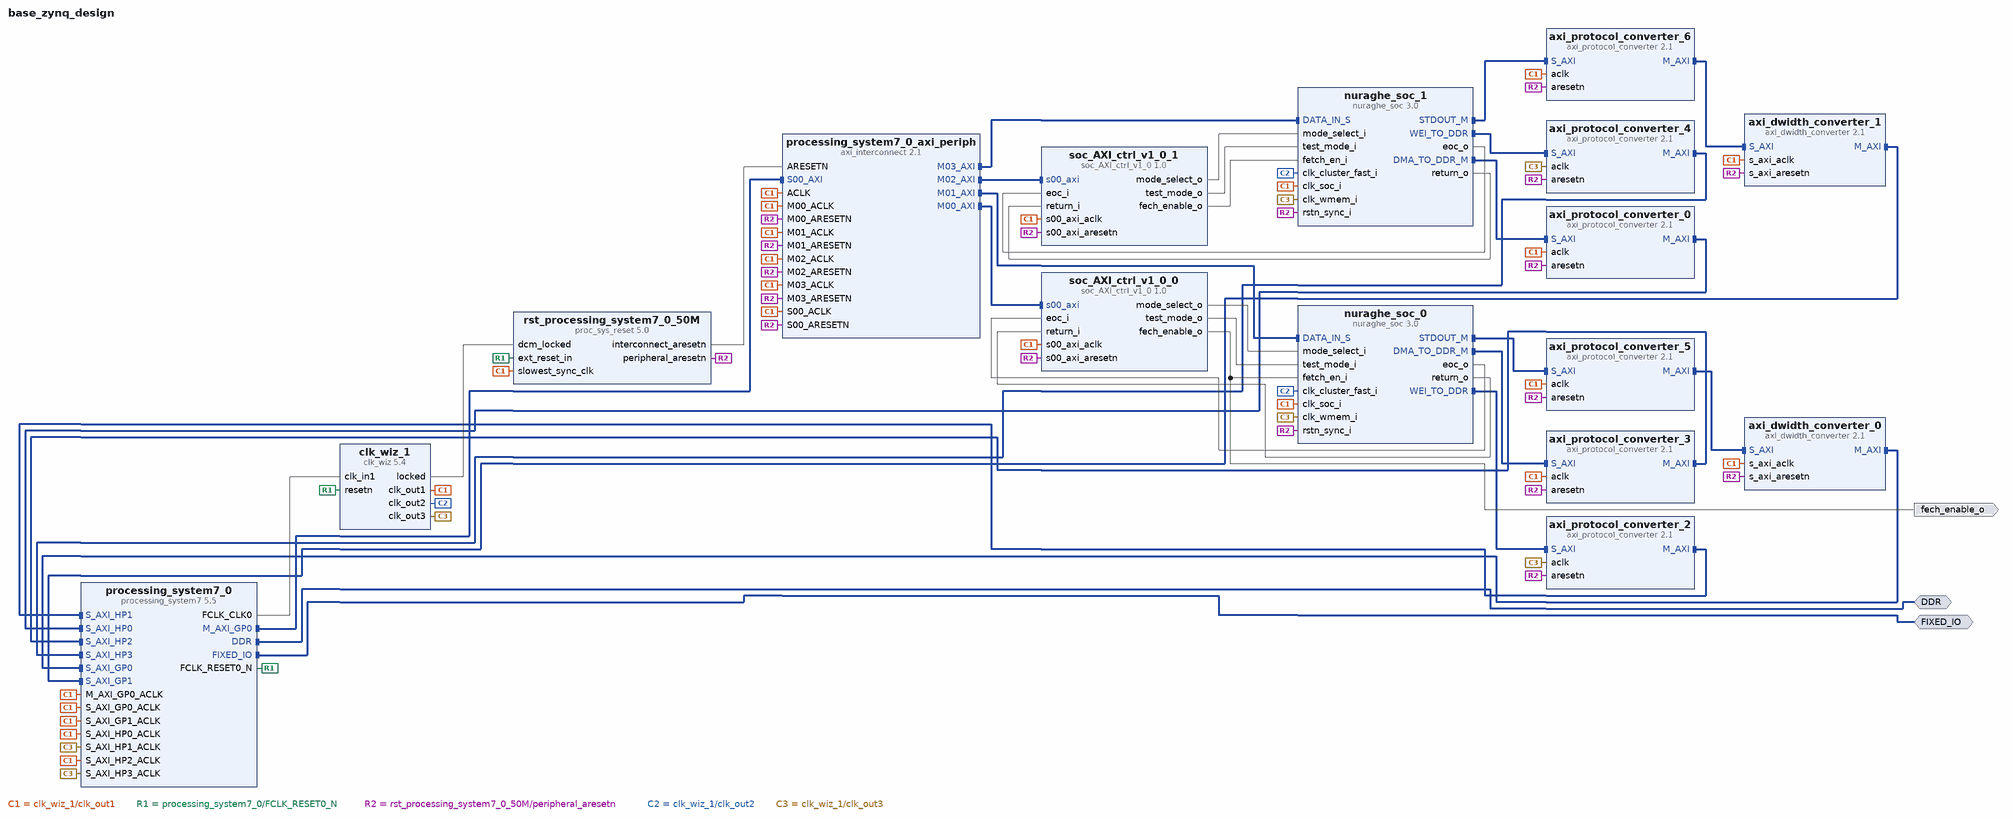
[diagram p0: block diagram of the top level]
# Vivado block design base_zynq_design, xc7z045ffg900-2, Vivado 2017.1
create_bd_design base_zynq_design

create_bd_intf_port -mode Master -vlnv xilinx.com:interface:ddrx_rtl:1.0 DDR
create_bd_intf_port -mode Master -vlnv xilinx.com:display_processing_system7:fixedio_rtl:1.0 FIXED_IO
create_bd_port -dir O fech_enable_o

create_bd_cell -type ip -vlnv xilinx.com:ip:clk_wiz:5.4 clk_wiz_1
set_property -dict [list \
  CONFIG.ENABLE_CLOCK_MONITOR false \
  CONFIG.PRIMITIVE MMCM \
  CONFIG.CLKOUT1_USED true \
  CONFIG.CLKOUT2_USED true \
  CONFIG.CLKOUT3_USED true \
  CONFIG.NUM_OUT_CLKS 3 \
  CONFIG.CLKOUT1_REQUESTED_OUT_FREQ 10 \
  CONFIG.CLKOUT2_REQUESTED_OUT_FREQ 20 \
  CONFIG.CLKOUT3_REQUESTED_OUT_FREQ 20 \
  CONFIG.FEEDBACK_SOURCE FDBK_AUTO \
  CONFIG.USE_LOCKED true \
  CONFIG.RESET_PORT resetn \
  CONFIG.MMCM_DIVCLK_DIVIDE 1 \
  CONFIG.MMCM_CLKFBOUT_MULT_F 10.000 \
  CONFIG.MMCM_CLKIN1_PERIOD 10.000 \
  CONFIG.MMCM_CLKIN2_PERIOD 10.000 \
  CONFIG.MMCM_COMPENSATION ZHOLD \
  CONFIG.MMCM_CLKOUT0_DIVIDE_F 100.000 \
  CONFIG.MMCM_CLKOUT1_DIVIDE 50 \
  CONFIG.MMCM_CLKOUT2_DIVIDE 50 \
  CONFIG.RESET_TYPE ACTIVE_LOW \
  CONFIG.CLKOUT1_JITTER 209.588 \
  CONFIG.CLKOUT1_PHASE_ERROR 98.575 \
  CONFIG.CLKOUT2_JITTER 183.243 \
  CONFIG.CLKOUT2_PHASE_ERROR 98.575 \
  CONFIG.CLKOUT3_JITTER 183.243 \
  CONFIG.CLKOUT3_PHASE_ERROR 98.575 \
] [get_bd_cells clk_wiz_1]
create_bd_cell -type ip -vlnv xilinx.com:ip:processing_system7:5.5 processing_system7_0
set_property -dict [list \
  CONFIG.PCW_UIPARAM_DDR_FREQ_MHZ 533.333313 \
  CONFIG.PCW_APU_PERIPHERAL_FREQMHZ 667.000000 \
  CONFIG.PCW_SDIO_PERIPHERAL_FREQMHZ 50 \
  CONFIG.PCW_UART_PERIPHERAL_FREQMHZ 50 \
  CONFIG.PCW_I2C_PERIPHERAL_FREQMHZ 111.111115 \
  CONFIG.PCW_FPGA0_PERIPHERAL_FREQMHZ 100 \
  CONFIG.PCW_FPGA1_PERIPHERAL_FREQMHZ 100 \
  CONFIG.PCW_USE_S_AXI_GP0 1 \
  CONFIG.PCW_USE_S_AXI_GP1 1 \
  CONFIG.PCW_USE_S_AXI_HP0 1 \
  CONFIG.PCW_USE_S_AXI_HP1 1 \
  CONFIG.PCW_USE_S_AXI_HP2 1 \
  CONFIG.PCW_USE_S_AXI_HP3 1 \
  CONFIG.PCW_PRESET_BANK0_VOLTAGE {LVCMOS 1.8V} \
  CONFIG.PCW_PRESET_BANK1_VOLTAGE {LVCMOS 1.8V} \
  CONFIG.PCW_UIPARAM_DDR_PARTNO Custom \
  CONFIG.PCW_QSPI_PERIPHERAL_ENABLE 1 \
  CONFIG.PCW_QSPI_QSPI_IO {MIO 1 .. 6} \
  CONFIG.PCW_QSPI_GRP_IO1_ENABLE 1 \
  CONFIG.PCW_QSPI_GRP_IO1_IO {MIO 0 9 .. 13} \
  CONFIG.PCW_QSPI_GRP_FBCLK_ENABLE 1 \
  CONFIG.PCW_QSPI_GRP_FBCLK_IO {MIO 8} \
  CONFIG.PCW_QSPI_INTERNAL_HIGHADDRESS 0xFDFFFFFF \
  CONFIG.PCW_ENET0_PERIPHERAL_ENABLE 1 \
  CONFIG.PCW_ENET0_ENET0_IO {MIO 16 .. 27} \
  CONFIG.PCW_ENET0_GRP_MDIO_ENABLE 1 \
  CONFIG.PCW_ENET0_GRP_MDIO_IO {MIO 52 .. 53} \
  CONFIG.PCW_ENET_RESET_ENABLE 1 \
  CONFIG.PCW_ENET_RESET_SELECT {Share reset pin} \
  CONFIG.PCW_ENET0_RESET_ENABLE 1 \
  CONFIG.PCW_ENET0_RESET_IO {MIO 47} \
  CONFIG.PCW_SD0_PERIPHERAL_ENABLE 1 \
  CONFIG.PCW_SD0_SD0_IO {MIO 40 .. 45} \
  CONFIG.PCW_SD0_GRP_CD_ENABLE 1 \
  CONFIG.PCW_SD0_GRP_CD_IO {MIO 14} \
  CONFIG.PCW_SD0_GRP_WP_ENABLE 1 \
  CONFIG.PCW_SD0_GRP_WP_IO {MIO 15} \
  CONFIG.PCW_UART1_PERIPHERAL_ENABLE 1 \
  CONFIG.PCW_UART1_UART1_IO {MIO 48 .. 49} \
  CONFIG.PCW_TTC0_PERIPHERAL_ENABLE 1 \
  CONFIG.PCW_TTC0_TTC0_IO EMIO \
  CONFIG.PCW_USB0_PERIPHERAL_ENABLE 1 \
  CONFIG.PCW_USB0_USB0_IO {MIO 28 .. 39} \
  CONFIG.PCW_USB_RESET_ENABLE 1 \
  CONFIG.PCW_USB_RESET_SELECT {Share reset pin} \
  CONFIG.PCW_USB0_RESET_ENABLE 1 \
  CONFIG.PCW_USB0_RESET_IO {MIO 7} \
  CONFIG.PCW_I2C0_PERIPHERAL_ENABLE 1 \
  CONFIG.PCW_I2C0_I2C0_IO {MIO 50 .. 51} \
  CONFIG.PCW_I2C0_RESET_ENABLE 1 \
  CONFIG.PCW_I2C0_RESET_IO {MIO 46} \
  CONFIG.PCW_I2C_RESET_ENABLE 1 \
  CONFIG.PCW_I2C_RESET_SELECT {Share reset pin} \
  CONFIG.PCW_GPIO_MIO_GPIO_ENABLE 1 \
  CONFIG.PCW_GPIO_MIO_GPIO_IO MIO \
  CONFIG.PCW_ENET0_PERIPHERAL_FREQMHZ {100 Mbps} \
  CONFIG.preset ZC706 \
] [get_bd_cells processing_system7_0]
# 189 more settings of processing_system7_0 are not shown: defaults, MIO pin electricals, DDR timing, and values the tool derives
create_bd_cell -type ip -vlnv xilinx.com:ip:axi_interconnect:2.1 processing_system7_0_axi_periph
set_property -dict {CONFIG.NUM_MI 4} [get_bd_cells processing_system7_0_axi_periph]
create_bd_cell -type ip -vlnv xilinx.com:ip:proc_sys_reset:5.0 rst_processing_system7_0_50M
create_bd_cell -type ip -vlnv xilinx.com:ip:axi_protocol_converter:2.1 axi_protocol_converter_2
create_bd_cell -type ip -vlnv xilinx.com:ip:axi_protocol_converter:2.1 axi_protocol_converter_0
create_bd_cell -type ip -vlnv xilinx.com:ip:axi_protocol_converter:2.1 axi_protocol_converter_3
set_property -dict [list \
  CONFIG.AWUSER_WIDTH 6 \
  CONFIG.ARUSER_WIDTH 6 \
  CONFIG.RUSER_WIDTH 6 \
  CONFIG.WUSER_WIDTH 6 \
] [get_bd_cells axi_protocol_converter_3]
create_bd_cell -type ip -vlnv user.org:user:soc_AXI_ctrl_v1_0:1.0 soc_AXI_ctrl_v1_0_0
set_property -dict {CONFIG.C_S00_AXI_ID_WIDTH 12} [get_bd_cells soc_AXI_ctrl_v1_0_0]
create_bd_cell -type ip -vlnv uniCA:user:nuraghe_soc:3.0 nuraghe_soc_0
create_bd_cell -type ip -vlnv uniCA:user:nuraghe_soc:3.0 nuraghe_soc_1
create_bd_cell -type ip -vlnv user.org:user:soc_AXI_ctrl_v1_0:1.0 soc_AXI_ctrl_v1_0_1
set_property -dict {CONFIG.C_S00_AXI_ID_WIDTH 12} [get_bd_cells soc_AXI_ctrl_v1_0_1]
create_bd_cell -type ip -vlnv xilinx.com:ip:axi_protocol_converter:2.1 axi_protocol_converter_4
create_bd_cell -type ip -vlnv xilinx.com:ip:axi_protocol_converter:2.1 axi_protocol_converter_5
set_property -dict [list \
  CONFIG.AWUSER_WIDTH 6 \
  CONFIG.ARUSER_WIDTH 6 \
  CONFIG.RUSER_WIDTH 6 \
  CONFIG.WUSER_WIDTH 6 \
] [get_bd_cells axi_protocol_converter_5]
create_bd_cell -type ip -vlnv xilinx.com:ip:axi_dwidth_converter:2.1 axi_dwidth_converter_0
create_bd_cell -type ip -vlnv xilinx.com:ip:axi_dwidth_converter:2.1 axi_dwidth_converter_1
create_bd_cell -type ip -vlnv xilinx.com:ip:axi_protocol_converter:2.1 axi_protocol_converter_6
set_property -dict [list \
  CONFIG.AWUSER_WIDTH 6 \
  CONFIG.ARUSER_WIDTH 6 \
  CONFIG.RUSER_WIDTH 6 \
  CONFIG.WUSER_WIDTH 6 \
] [get_bd_cells axi_protocol_converter_6]

# ---- connections ----

connect_bd_intf_net [get_bd_intf_pins processing_system7_0/M_AXI_GP0] [get_bd_intf_pins processing_system7_0_axi_periph/S00_AXI]
connect_bd_intf_net [get_bd_intf_pins soc_AXI_ctrl_v1_0_0/s00_axi] [get_bd_intf_pins processing_system7_0_axi_periph/M00_AXI]
connect_bd_intf_net [get_bd_intf_pins processing_system7_0/S_AXI_HP1] [get_bd_intf_pins axi_protocol_converter_2/M_AXI]
connect_bd_intf_net [get_bd_intf_pins processing_system7_0_axi_periph/M01_AXI] [get_bd_intf_pins nuraghe_soc_0/DATA_IN_S]
connect_bd_intf_net [get_bd_intf_pins axi_protocol_converter_0/M_AXI] [get_bd_intf_pins processing_system7_0/S_AXI_HP0]
connect_bd_intf_net [get_bd_intf_pins axi_protocol_converter_3/M_AXI] [get_bd_intf_pins processing_system7_0/S_AXI_HP2]
connect_bd_intf_net [get_bd_intf_pins nuraghe_soc_0/WEI_TO_DDR] [get_bd_intf_pins axi_protocol_converter_2/S_AXI]
connect_bd_intf_net [get_bd_intf_pins nuraghe_soc_0/DMA_TO_DDR_M] [get_bd_intf_pins axi_protocol_converter_3/S_AXI]
connect_bd_intf_net [get_bd_intf_pins soc_AXI_ctrl_v1_0_1/s00_axi] [get_bd_intf_pins processing_system7_0_axi_periph/M02_AXI]
connect_bd_intf_net [get_bd_intf_pins processing_system7_0_axi_periph/M03_AXI] [get_bd_intf_pins nuraghe_soc_1/DATA_IN_S]
connect_bd_intf_net [get_bd_intf_pins nuraghe_soc_1/DMA_TO_DDR_M] [get_bd_intf_pins axi_protocol_converter_0/S_AXI]
connect_bd_intf_net [get_bd_intf_pins axi_protocol_converter_4/M_AXI] [get_bd_intf_pins processing_system7_0/S_AXI_HP3]
connect_bd_intf_net [get_bd_intf_pins nuraghe_soc_1/WEI_TO_DDR] [get_bd_intf_pins axi_protocol_converter_4/S_AXI]
connect_bd_intf_net [get_bd_intf_pins nuraghe_soc_0/STDOUT_M] [get_bd_intf_pins axi_protocol_converter_5/S_AXI]
connect_bd_intf_net [get_bd_intf_pins axi_protocol_converter_5/M_AXI] [get_bd_intf_pins axi_dwidth_converter_0/S_AXI]
connect_bd_intf_net [get_bd_intf_pins axi_dwidth_converter_0/M_AXI] [get_bd_intf_pins processing_system7_0/S_AXI_GP0]
connect_bd_intf_net [get_bd_intf_pins axi_protocol_converter_6/M_AXI] [get_bd_intf_pins axi_dwidth_converter_1/S_AXI]
connect_bd_intf_net [get_bd_intf_pins axi_dwidth_converter_1/M_AXI] [get_bd_intf_pins processing_system7_0/S_AXI_GP1]
connect_bd_intf_net [get_bd_intf_pins nuraghe_soc_1/STDOUT_M] [get_bd_intf_pins axi_protocol_converter_6/S_AXI]
connect_bd_intf_net [get_bd_intf_ports DDR] [get_bd_intf_pins processing_system7_0/DDR]
connect_bd_intf_net [get_bd_intf_ports FIXED_IO] [get_bd_intf_pins processing_system7_0/FIXED_IO]
connect_bd_net -net processing_system7_0_FCLK_CLK0 [get_bd_pins clk_wiz_1/clk_out1] \
  [get_bd_pins processing_system7_0/M_AXI_GP0_ACLK] [get_bd_pins processing_system7_0/S_AXI_GP0_ACLK] \
  [get_bd_pins processing_system7_0/S_AXI_HP0_ACLK] [get_bd_pins rst_processing_system7_0_50M/slowest_sync_clk] \
  [get_bd_pins processing_system7_0/S_AXI_HP2_ACLK] [get_bd_pins axi_protocol_converter_0/aclk] \
  [get_bd_pins axi_protocol_converter_3/aclk] [get_bd_pins soc_AXI_ctrl_v1_0_0/s00_axi_aclk] \
  [get_bd_pins nuraghe_soc_0/clk_soc_i] [get_bd_pins processing_system7_0_axi_periph/ACLK] \
  [get_bd_pins processing_system7_0_axi_periph/S00_ACLK] [get_bd_pins processing_system7_0_axi_periph/M00_ACLK] \
  [get_bd_pins processing_system7_0_axi_periph/M01_ACLK] [get_bd_pins nuraghe_soc_1/clk_soc_i] \
  [get_bd_pins soc_AXI_ctrl_v1_0_1/s00_axi_aclk] [get_bd_pins processing_system7_0/S_AXI_GP1_ACLK] \
  [get_bd_pins processing_system7_0_axi_periph/M02_ACLK] [get_bd_pins processing_system7_0_axi_periph/M03_ACLK] \
  [get_bd_pins axi_protocol_converter_5/aclk] [get_bd_pins axi_dwidth_converter_0/s_axi_aclk] \
  [get_bd_pins axi_protocol_converter_6/aclk] [get_bd_pins axi_dwidth_converter_1/s_axi_aclk]
connect_bd_net [get_bd_pins processing_system7_0/FCLK_RESET0_N] [get_bd_pins clk_wiz_1/resetn] [get_bd_pins rst_processing_system7_0_50M/ext_reset_in]
connect_bd_net [get_bd_pins rst_processing_system7_0_50M/peripheral_aresetn] \
  [get_bd_pins axi_protocol_converter_2/aresetn] [get_bd_pins axi_protocol_converter_0/aresetn] \
  [get_bd_pins axi_protocol_converter_3/aresetn] [get_bd_pins soc_AXI_ctrl_v1_0_0/s00_axi_aresetn] \
  [get_bd_pins nuraghe_soc_0/rstn_sync_i] [get_bd_pins processing_system7_0_axi_periph/S00_ARESETN] \
  [get_bd_pins processing_system7_0_axi_periph/M00_ARESETN] [get_bd_pins processing_system7_0_axi_periph/M01_ARESETN] \
  [get_bd_pins nuraghe_soc_1/rstn_sync_i] [get_bd_pins soc_AXI_ctrl_v1_0_1/s00_axi_aresetn] \
  [get_bd_pins axi_protocol_converter_4/aresetn] [get_bd_pins processing_system7_0_axi_periph/M03_ARESETN] \
  [get_bd_pins processing_system7_0_axi_periph/M02_ARESETN] [get_bd_pins axi_protocol_converter_5/aresetn] \
  [get_bd_pins axi_dwidth_converter_0/s_axi_aresetn] [get_bd_pins axi_protocol_converter_6/aresetn] \
  [get_bd_pins axi_dwidth_converter_1/s_axi_aresetn]
connect_bd_net [get_bd_pins rst_processing_system7_0_50M/interconnect_aresetn] [get_bd_pins processing_system7_0_axi_periph/ARESETN]
connect_bd_net [get_bd_pins soc_AXI_ctrl_v1_0_0/fech_enable_o] [get_bd_ports fech_enable_o] [get_bd_pins nuraghe_soc_0/fetch_en_i]
connect_bd_net [get_bd_pins soc_AXI_ctrl_v1_0_0/mode_select_o] [get_bd_pins nuraghe_soc_0/mode_select_i]
connect_bd_net [get_bd_pins processing_system7_0/FCLK_CLK0] [get_bd_pins clk_wiz_1/clk_in1]
connect_bd_net [get_bd_pins clk_wiz_1/clk_out2] [get_bd_pins nuraghe_soc_0/clk_cluster_fast_i] [get_bd_pins nuraghe_soc_1/clk_cluster_fast_i]
connect_bd_net [get_bd_pins clk_wiz_1/locked] [get_bd_pins rst_processing_system7_0_50M/dcm_locked]
connect_bd_net [get_bd_pins soc_AXI_ctrl_v1_0_0/test_mode_o] [get_bd_pins nuraghe_soc_0/test_mode_i]
connect_bd_net [get_bd_pins nuraghe_soc_0/eoc_o] [get_bd_pins soc_AXI_ctrl_v1_0_0/eoc_i]
connect_bd_net [get_bd_pins nuraghe_soc_0/return_o] [get_bd_pins soc_AXI_ctrl_v1_0_0/return_i]
connect_bd_net [get_bd_pins clk_wiz_1/clk_out3] \
  [get_bd_pins processing_system7_0/S_AXI_HP1_ACLK] [get_bd_pins axi_protocol_converter_2/aclk] \
  [get_bd_pins nuraghe_soc_0/clk_wmem_i] [get_bd_pins nuraghe_soc_1/clk_wmem_i] [get_bd_pins axi_protocol_converter_4/aclk] \
  [get_bd_pins processing_system7_0/S_AXI_HP3_ACLK]
connect_bd_net [get_bd_pins soc_AXI_ctrl_v1_0_1/mode_select_o] [get_bd_pins nuraghe_soc_1/mode_select_i]
connect_bd_net [get_bd_pins soc_AXI_ctrl_v1_0_1/test_mode_o] [get_bd_pins nuraghe_soc_1/test_mode_i]
connect_bd_net [get_bd_pins soc_AXI_ctrl_v1_0_1/fech_enable_o] [get_bd_pins nuraghe_soc_1/fetch_en_i]
connect_bd_net [get_bd_pins nuraghe_soc_1/eoc_o] [get_bd_pins soc_AXI_ctrl_v1_0_1/eoc_i]
connect_bd_net [get_bd_pins nuraghe_soc_1/return_o] [get_bd_pins soc_AXI_ctrl_v1_0_1/return_i]

# ---- address map ----
assign_bd_address -offset 0x43C00000 -range 64K -target_address_space [get_bd_addr_spaces processing_system7_0/Data] [get_bd_addr_segs soc_AXI_ctrl_v1_0_0/s00_axi/reg0]
assign_bd_address -offset 0x43C10000 -range 64K -target_address_space [get_bd_addr_spaces processing_system7_0/Data] [get_bd_addr_segs soc_AXI_ctrl_v1_0_1/s00_axi/reg0]
assign_bd_address -offset 0x50000000 -range 256M -target_address_space [get_bd_addr_spaces processing_system7_0/Data] [get_bd_addr_segs nuraghe_soc_0/DATA_IN_S/Reg]
assign_bd_address -offset 0x60000000 -range 256M -target_address_space [get_bd_addr_spaces processing_system7_0/Data] [get_bd_addr_segs nuraghe_soc_1/DATA_IN_S/Reg]

validate_bd_design
save_bd_design
